# EasyEDA schematic 1-Schematic_rdb ruler.json
TITLE: Sheet_1; REV: 1.0; Date: 2020-08-20; Sheet: 1/1; Drawn By: Toster124; Company: Your Company
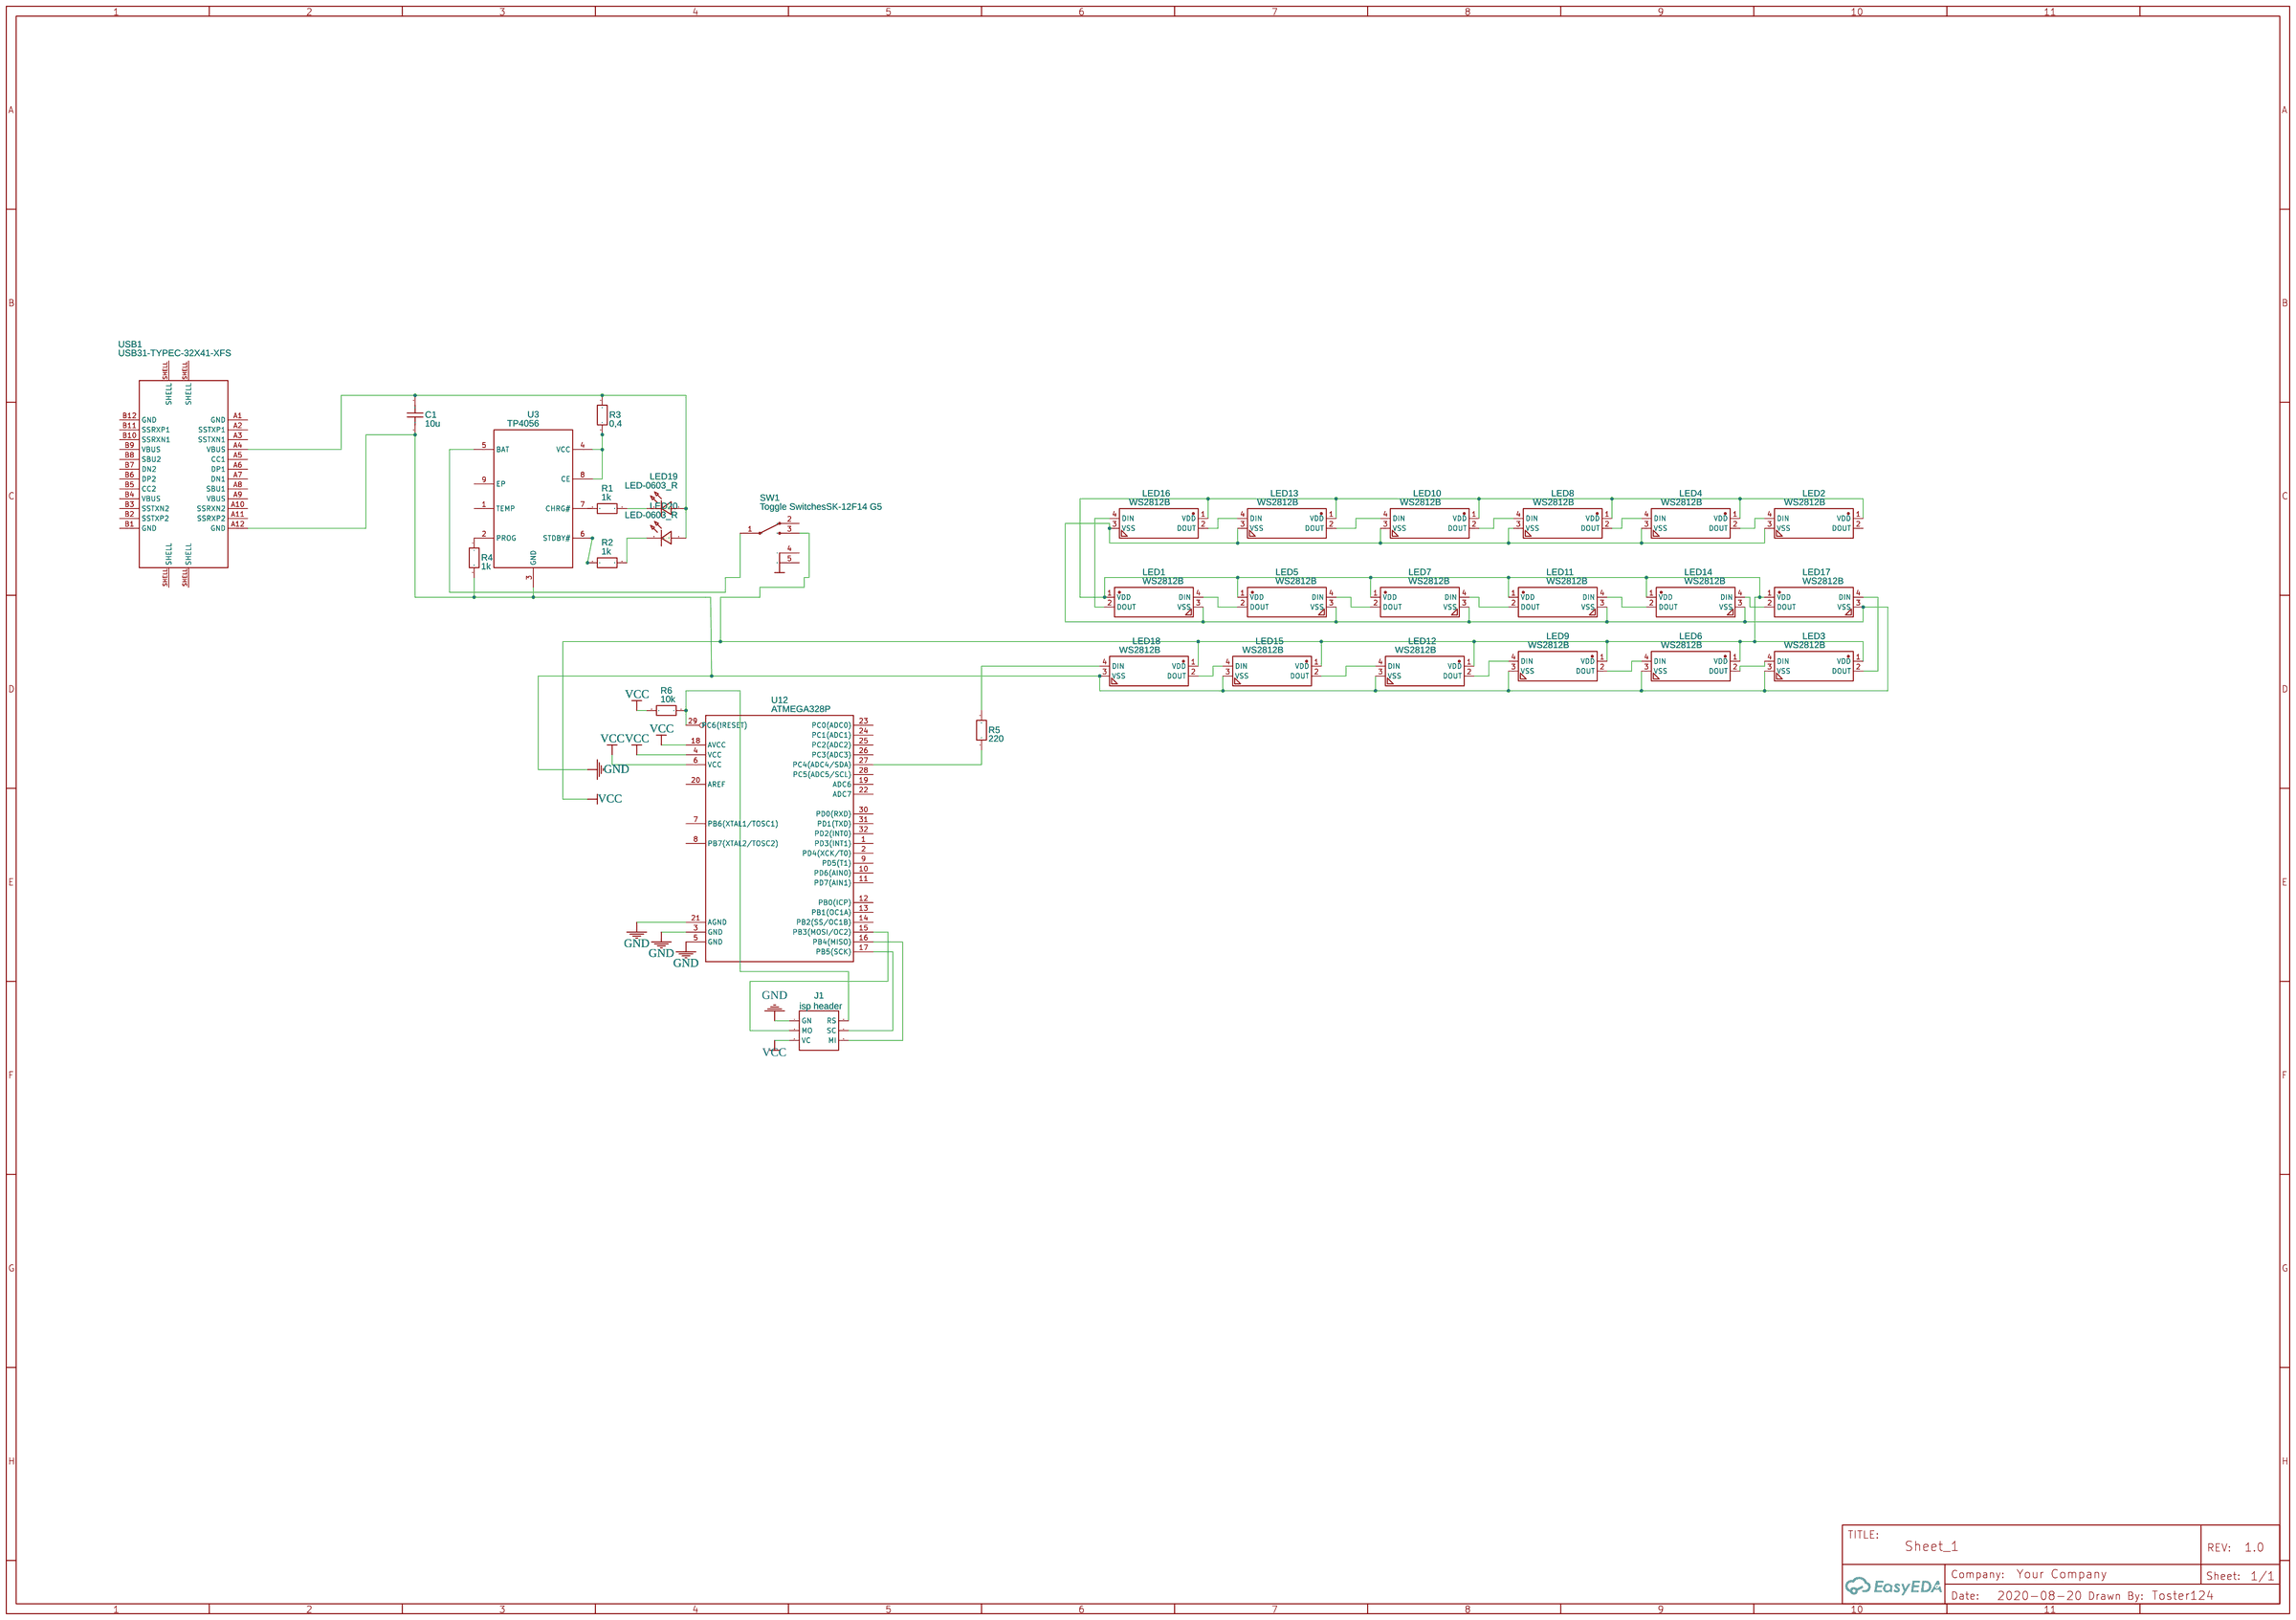
[diagram p0: schematic sheet]

## Parts
C1  10u  [C0603]
J1  isp header  [HDR-TH_6PIN-V-ROW2-COL3-MALE-PITCH2.54]
LED1  WS2812B  [LED-SMD_4P-L5.0-W5.0-TL]
LED2  WS2812B  [LED-SMD_4P-L5.0-W5.0-TL]
LED3  WS2812B  [LED-SMD_4P-L5.0-W5.0-TL]
LED4  WS2812B  [LED-SMD_4P-L5.0-W5.0-TL]
LED5  WS2812B  [LED-SMD_4P-L5.0-W5.0-TL]
LED6  WS2812B  [LED-SMD_4P-L5.0-W5.0-TL]
LED7  WS2812B  [LED-SMD_4P-L5.0-W5.0-TL]
LED8  WS2812B  [LED-SMD_4P-L5.0-W5.0-TL]
LED9  WS2812B  [LED-SMD_4P-L5.0-W5.0-TL]
LED10  WS2812B  [LED-SMD_4P-L5.0-W5.0-TL]
LED11  WS2812B  [LED-SMD_4P-L5.0-W5.0-TL]
LED12  WS2812B  [LED-SMD_4P-L5.0-W5.0-TL]
LED13  WS2812B  [LED-SMD_4P-L5.0-W5.0-TL]
LED14  WS2812B  [LED-SMD_4P-L5.0-W5.0-TL]
LED15  WS2812B  [LED-SMD_4P-L5.0-W5.0-TL]
LED16  WS2812B  [LED-SMD_4P-L5.0-W5.0-TL]
LED17  WS2812B  [LED-SMD_4P-L5.0-W5.0-TL]
LED18  WS2812B  [LED-SMD_4P-L5.0-W5.0-TL]
LED19  LED-0603_R  [LED0603_RED]
LED20  LED-0603_R  [LED0603_RED]
R1  1k  [R0603]
R2  1k  [R0603]
R3  0,4  [R0603]
R4  1k  [R0603]
R5  220  [R0603]
R6  10k  [R0603]
SW1  Toggle SwitchesSK-12F14 G5  [SW-TH_SK-12F14-G]
U3  TP4056  [ESOP-8_L4.9-W3.9-P1.27-LS6.0-BL-EP]
U12  ATMEGA328P  [TQFP-32]
USB1  USB31-TYPEC-32X41-XFS  [USB-3.1-SMD_USB31-TYPEC-32X41-XFS]

## Library data of the parts
C1 = C_0603_US: Contributor: LCEDA_Lib
J1 = -: Supplier: LCSC; Manufacturer: BOOMELE; Manufacturer Part: Header-Male-2.54_2x3; Supplier Part: C65114
LED1-LED18 = WS2812B: Supplier: LCSC; Manufacturer: Worldsemi; Contributor: LCSC; Supplier Part: C114585; LCSC Assembly: Yes; SMT Type: Extend
LED19 LED20 = LED-0603_R: Manufacturer: EVERLIGHT(台湾亿光); Manufacturer Part: 19-217/R6C-AL1M2VY/3T; Supplier Part: C72044; Supplier: LCSC; Contributor: LCEDA_01
R1 R2 R4-R6 = R_0603_EU: Contributor: LCEDA_Lib
R3 = R_0603_EU: Contributor: LCEDA_Lib; Package Display: No
SW1 = Toggle SwitchesSK-12F14 G5: Supplier Part: C59902; Supplier: LCSC; Manufacturer: ReliaPro; image: http://image.lceda.cn/szlcsc/C59902.jpg
U3 = TP4056: Contributor: Guest; Supplier: LCSC; Manufacturer: TOPPOWER; LCSC Assembly: Yes; image: //image.lceda.cn/szlcsc/C16581.jpg; Supplier Part: C16581; SMT Type: Basic
U12 = -: Contributor: GiaTech_E_Team
USB1 = USB31-TYPEC-32X41-XFS: Supplier: LCSC; Supplier Part: C319152; Manufacturer: XKB Enterprise; Contributor: LCSC

## Nets
GND: C1.2 J1.1(GN) LED1.3(VSS) LED2.3(VSS) LED3.3(VSS) LED4.3(VSS) LED5.3(VSS) LED6.3(VSS) LED7.3(VSS) LED8.3(VSS) LED9.3(VSS) LED10.3(VSS) LED11.3(VSS) LED12.3(VSS) LED13.3(VSS) LED14.3(VSS) LED15.3(VSS) LED16.3(VSS) LED17.3(VSS) LED18.3(VSS) R4.2 U3.3(GND) U12.3(GND) U12.5(GND) U12.21(AGND) USB1.A12(GND)
VCC: J1.5(VC) LED1.1(VDD) LED2.1(VDD) LED3.1(VDD) LED4.1(VDD) LED5.1(VDD) LED6.1(VDD) LED7.1(VDD) LED8.1(VDD) LED9.1(VDD) LED10.1(VDD) LED11.1(VDD) LED12.1(VDD) LED13.1(VDD) LED14.1(VDD) LED15.1(VDD) LED16.1(VDD) LED17.1(VDD) LED18.1(VDD) R6.1 SW1.3 U12.4(VCC) U12.6(VCC) U12.18(AVCC)
Net-(C1-1): C1.1 LED19.1 LED20.1 R3.1 USB1.A4(VBUS)
Net-(J1-2): J1.2(RS) R6.2 U12.29(PC6(!RESET))
Net-(J1-3): J1.3(MO) U12.15(PB3(MOSI/OC2))
Net-(J1-4): J1.4(SC) U12.17(PB5(SCK))
Net-(J1-6): J1.6(MI) U12.16(PB4(MISO))
Net-(LED1-2): LED1.2(DOUT) LED16.4(DIN)
Net-(LED1-4): LED1.4(DIN) LED5.2(DOUT)
Net-(LED2-4): LED2.4(DIN) LED4.2(DOUT)
Net-(LED3-2): LED3.2(DOUT) LED17.4(DIN)
Net-(LED3-4): LED3.4(DIN) LED6.2(DOUT)
Net-(LED4-4): LED4.4(DIN) LED8.2(DOUT)
Net-(LED5-4): LED5.4(DIN) LED7.2(DOUT)
Net-(LED6-4): LED6.4(DIN) LED9.2(DOUT)
Net-(LED7-4): LED7.4(DIN) LED11.2(DOUT)
Net-(LED8-4): LED8.4(DIN) LED10.2(DOUT)
Net-(LED9-4): LED9.4(DIN) LED12.2(DOUT)
Net-(LED10-4): LED10.4(DIN) LED13.2(DOUT)
Net-(LED11-4): LED11.4(DIN) LED14.2(DOUT)
Net-(LED12-4): LED12.4(DIN) LED15.2(DOUT)
Net-(LED13-4): LED13.4(DIN) LED16.2(DOUT)
Net-(LED14-4): LED14.4(DIN) LED17.2(DOUT)
Net-(LED15-4): LED15.4(DIN) LED18.2(DOUT)
Net-(LED18-4): LED18.4(DIN) R5.2
Net-(LED19-2): LED19.2 R1.2
Net-(LED20-2): LED20.2 R2.2
Net-(R2-1): R2.1 U3.6(STDBY#)
Net-(R3-2): R3.2 U3.4(VCC) U3.8(CE)
Net-(R4-1): R4.1 U3.2(PROG)
Net-(R5-1): R5.1 U12.27(PC4(ADC4/SDA))
Net-(SW1-1): SW1.1 U3.5(BAT)

Not connected (* = marked no-connect by the designer): LED2 2(DOUT); R1 1; SW1 2 4 5; U3 1(TEMP) 7(CHRG#) 9(EP); U12 1(PD3(INT1)) 2(PD4(XCK/T0)) 7(PB6(XTAL1/TOSC1)) 8(PB7(XTAL2/TOSC2)) 9(PD5(T1)) 10(PD6(AIN0)) 11(PD7(AIN1)) 12(PB0(ICP)) 13(PB1(OC1A)) 14(PB2(SS/OC1B)) 19(ADC6) 20(AREF) 22(ADC7) 23(PC0(ADC0)) 24(PC1(ADC1)) 25(PC2(ADC2)) 26(PC3(ADC3)) 28(PC5(ADC5/SCL)) 30(PD0(RXD)) 31(PD1(TXD)) 32(PD2(INT0)); USB1 A1(GND) A2(SSTXP1) A3(SSTXN1) A5(CC1) A6(DP1) A7(DN1) A8(SBU1) A9(VBUS) A10(SSRXN2) A11(SSRXP2) B1(GND) B2(SSTXP2) B3(SSTXN2) B4(VBUS) B5(CC2) B6(DP2) B7(DN2) B8(SBU2) B9(VBUS) B10(SSRXN1) B11(SSRXP1) B12(GND) SHELL
